# Altium schematic sheet Schema_Soldeerbout2.SchDoc
size A4; SheetNumber: 2; SheetTotal: 6
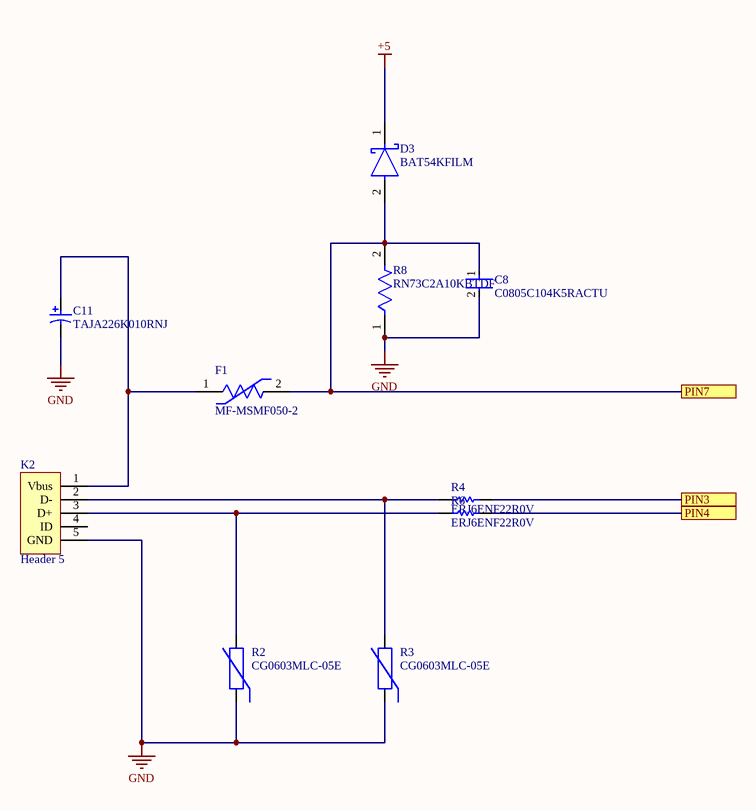
[diagram p0: Schema_Soldeerbout2.SchDoc]

## Parts
C8  C0805C104K5RACTU  [FP-C0805C-DN-MFG]
C11  TAJA226K010RNJ  [AVX-TAJ-A-2_L]
D3  BAT54KFILM  [FP-SOD-523-MFG]
F1  MF-MSMF050-2  [FP-MF-MSMF050-2-MFG]
K2  Header 5  [HDR1X5]
R2  CG0603MLC-05E  [BOUR-CG0603-2_V]
R3  CG0603MLC-05E  [BOUR-CG0603-2_V]
R4  ERJ6ENF22R0V  [RESC2013X70X40LL20T20]
R6  ERJ6ENF22R0V  [RESC2013X70X40LL20T20]
R8  RN73C2A10KBTDF  [FP-RN732A-MFG]

## Ports
PIN3, PIN4, PIN7

## Nets
+5: D3.1(C)
GND: C8.2 C11.2 K2.5(GND) R2.1 R3.1 R8.1
PIN3: R4.2 ; port PIN3
PIN4: R6.2 ; port PIN4
PIN7: C8.1 D3.2(A) F1.2 R8.2 ; port PIN7
NetC11_1: C11.1 F1.1 K2.1(Vbus)
NetK2_2: K2.2(D-) R3.2 R4.1
NetK2_3: K2.3(D+) R2.2 R6.1

Not connected (* = marked no-connect by the designer): K2 4(ID)

## Library data of the parts
C8 = CMP-2007-00279-2: CAP CER 0.1UF 50V X7R 0805; Manufacturer: KEMET; Value: 0.10 μF; Tolerance: 0.1; Temperature Coefficient: 30ppm/°C; Material: Ceramic; Manufacturer Part Number: C0805C104K5RACTU; Device Class L2: Capacitors; Temperature Range Low: -55°C; Voltage Rating: 50 V; Digikey Description: CAP CER 0.1UF 50V X7R 0805; Category: Cap; ComponentLink2Description: Datasheet; Octopart: https://octopart.com/c0805c104k5ractu-kemet-143926; RoHS: TRUE; ComponentLink2URL: https://content.kemet.com/datasheets/KEM_C1003_C0G_SMD.pdf; Temperature Characteristic: X7R; Temperature: -55°C to +125°C; Height: 0.88mm; Temperature Range High: +125°C; Device Class L1: Passive Components; Automotive: No; Lead Free: Yes; Ipc Land Pattern Name: CAPC200125X78; Device Class L3: Ceramic Capacitors; Mouser Description: Cap Ceramic 0.1uF 50V X7R 10% SMD 2.0 x 1.2 mm 125 C Paper T/R; Capacitance: 0.10 μF; Package: C0805C-DN
C11 = CMP-2000-07524-1: Chip Capacitor, 22 uF, +/- 10%, 10 V, -55 to 125 degC, 1206 (3216 Metric), RoHS, Tape and Reel; Manufacturer: AVX; Leakage Current: 2.2uA; Polarity: Polar; Dielectric Material: Tantalum; Voltage Rating (DC): 10V; Dissipation Factor: 8%; ESR (Equivalent Series Resistance): 3Ohm; Capacitance: 22uF; Height - Seated (Max): 0.071inch; Number of Pins: 2; Termination: SMD/SMT; Package Quantity: 1; Datasheet Version: 09/2017; Packaging: TapeandReel; Case/Package: 1206; Lead Free: LeadFree; Manufacturer URL: http://www.avx.com/; RoHSCompliant: True; Mount: PCB; Package Reference: TAJ-A-2; Width: 1.6mm; Height: 1.6mm; Radiation Hardening: No; Lead Pitch: 1.1mm; Tolerance: 10%; REACH SVHC: NoSVHC; Depth: 1.6mm; Package Description: 2-Pin Surface Mount Device, Body 3.2 x 1.65 mm; Case Code (Metric): 3216; Case Code (Imperial): 1206; Mounting Technology: SurfaceMount; Datasheet URL: http://datasheets.avx.com/TAJ.pdf; Voltage: 10V; Length: 3.2mm; Max Operating Temperature: 125degC; Voltage Rating: 10V; Min Operating Temperature: -55degC
D3 = CMP-12187-000026-1: DIODE SCHOTTKY 40V 300MA SOD523; Manufacturer: STMicroelectronics; Capacitance: 7pF; Value: 7pF; Max Surge Forward Current: 1.25A; Peak Reverse Current: 1uA; Max Junction Temp: +150°C; Device Class L2: Diodes; Temperature Range Low: -40°C; Category: Diode; Manufacturer Part Number: BAT54KFILM; Digikey Description: DIODE SCHOTTKY 40V 300MA SOD523; Device Class L3: Schottky Diodes; Automotive: No; Height: 0.7mm; Octopart: https://octopart.com/bat54kfilm-stmicroelectronics-39618022; ComponentLink2Description: Datasheet; Temperature Range High: +150°C; Device Class L1: Discrete Semiconductors; Max Repetitive Reverse Voltage: 40V; RoHS: TRUE; Temperature: -40°C to +150°C; ComponentLink2URL: https://www.st.com/content/ccc/resource/technical/document/datasheet/07/50/54/f2/0d/ba/4a/79/CD00001322.pdf/files/CD00001322.pdf/jcr:content/translations/en.CD00001322.pdf; Lead Free: Yes; Forward Current: 300mA; Package: SOD-523; Mouser Description: Schottky Diodes & Rectifiers schottky diode
F1 = CMP-2100-03653-2: PTC RESET FUSE 15V 500MA 1812; Manufacturer: Bourns; Value: 0.15-1Ω; Trip Current: 1A; Automotive Grade: Grade 3; Trip Time: 0.15s; Current Rating: 100A; Hold Current: 0.5A; Height: 0.85mm; Package: 1812; Voltage Rating: 15V; Temperature Range High: +85°C; Device Class L2: PTC Resettable Fuses; Lead Free: Yes; ComponentLink2URL: http://www.bourns.com/docs/Product-Datasheets/mfmsmf.pdf; Ambient Temperature Range High: +85°C; Mouser Description: PTC Resettable Fuse 0.5A(hold) 1A(trip) 15V 100A 0.8W 0.15s 0.15Ohm SMD Solder Pad 1812 T/R; Digikey Description: PTC RESET FUSE 15V 500MA 1812; Manufacturer Part Number: MF-MSMF050-2; Resistance: 0.15-1Ω; Category: Fuse; ComponentLink2Description: Datasheet; Automotive: Yes; Temperature Range Low: -40°C; RoHS: TRUE; Device Class L1: Circuit Protection; Temperature: -40°C to +85°C; Octopart: https://octopart.com/mf-msmf050-2-bourns-28047; Ambient Temperature Range Low: -40°C; Device Class L3: unset
K2 = Header 5: Header, 5-Pin; LatestRevisionDate: 17-Jul-2002; LatestRevisionNote: Re-released for DXP Platform.; Publisher: Altium Limited
R2 R3 = CMP-0584-00001-2: ESD Protector, 5 V Supply, -40 to 85 degC, 1.6 x 0.8 x 0.55 mm SMD, RoHS, Tape and Reel; Manufacturer: Bourns; VC: 20 V; VT: 150 V; RT: 1 ns; VDC: 5 V; CO: 0.5 pF; PartNumber: CG0603MLC-05E; ComponentLink1Description: Manufacturer URL; ComponentLink1URL: http://www.bourns.com/; Packing: Tape and Reel; Mounting Technology: Surface Mount; ComponentLink2Description: Datasheet; RoHS: TRUE; Operating Temperature: -40 to 85 degC; DatasheetVersion: Rev. S; PackageDescription: 2-Pin SMD, Body 1.6 x 0.8 mm, Pitch 1.52 mm; PackageReference: CG0603-2; ComponentLink2URL: http://www.bourns.com/data/global/pdfs/MLC.pdf
R4 R6 = CMP-2001-00523-1: Manufacturer: Panasonic; Part Number: ERJ6ENF22R0V
R8 = CMP-03211-000130-1: SMD Chip Resistor, Thin Film, 10KΩ, 100 V, 0805 [2012 Metric], 100 mW, 0.1%, RN73 Series; Manufacturer: TE Connectivity; Power Rating: 0.1W; Temperature Coefficient: 10ppm/°C; Voltage Rating: 100V; Package: RN732A; Ipc Land Pattern Name: RESC200125X55; RoHS: TRUE; packaging: 1000 Reel; Resistance: 10KΩ; Octopart: https://octopart.com/rn73c2a10kbtdf-te+connectivity-21400356; Temperature Range Low: -55°C; Device Class L1: Passive Components; Tolerance: 0.1%; ComponentLink2URL: https://www.te.com/commerce/DocumentDelivery/DDEController?Action=showdoc&DocId=Data+Sheet%7F1773270%7FP%7Fpdf%7FEnglish%7FENG_DS_1773270_P.pdf%7F1676162-2; Height: 0.65mm; Composition: Thin Film; Temperature Range High: 155°C; Automotive: No; Series: RN73; Lead Free: Yes; Value: 10KΩ; Category: Res; Device Class L2: Resistors; Temperature: -55°C to 155°C; octopart_url: https://octopart.com/rn73c2a10kbtdf-te+connectivity-21400356; Device Class L3: Chip SMD Resistors; ComponentLink2Description: Datasheet; Manufacturer Part Number: RN73C2A10KBTDF